# Altium schematic sheet PART9_0_Volt_Protec_Simple.SchDoc
size A4
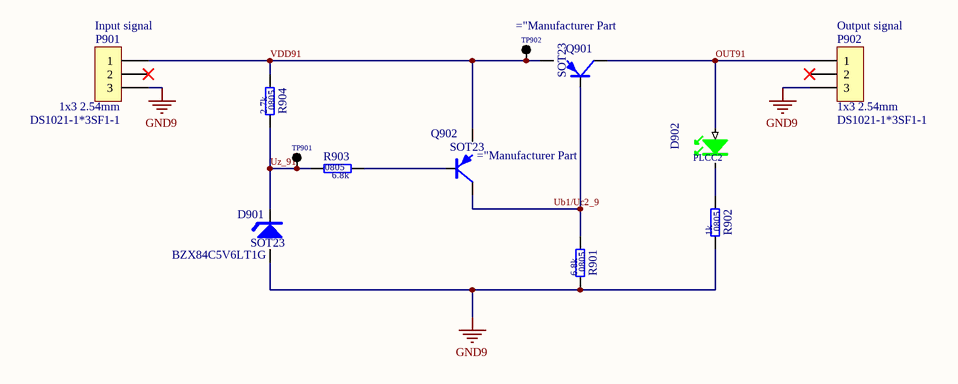
[diagram p0: PART9_0_Volt_Protec_Simple.SchDoc]

## Parts
D901  value BZX84C5V6LT1G  SCH_Footprint: SOT23  [D_SOT23_TO236_SC59]
D902  SCH_Footprint: PLCC2  [OL_PLCC2_3X2X13]
P901  Input signal  value DS1021-1*3SF1-1  SCH_Footprint: 1x3 2.54mm  [P_HEADER_1x3_2.54]
P902  Output signal  value DS1021-1*3SF1-1  SCH_Footprint: 1x3 2.54mm  [P_HEADER_1x3_2.54]
Q901  SCH_Footprint: SOT23  [SOT23_TO236_SC59]  (hidden comment: FMMT718)
Q902  SCH_Footprint: SOT23  [SOT23_TO236_SC59]  (hidden comment: FMMT718)
R901  value 6.8k  SCH_Footprint: 0805  [R_0805_2012]  (hidden comment: Resistor)
R902  value 1k  SCH_Footprint: 0805  [R_0805_2012]  (hidden comment: Resistor)
R903  value 6.8k  SCH_Footprint: 0805  [R_0805_2012]  (hidden comment: Resistor)
R904  value 2.7k  SCH_Footprint: 0805  [R_0805_2012]  (hidden comment: Resistor)
TP901  Single pin  [TP_1PIN]  (value not drawn)
TP902  Single pin  [TP_1PIN]  (value not drawn)

## Nets
GND9: D901.2(A) P901.3 P902.3 R901.1 R902.1
OUT91: D902.2(A) P902.1 Q901.3(C)
Ub1/Uc2_9: Q901.1(B) Q902.3(C) R901.2
Uz_91: D901.1(K) R903.2 R904.1 TP901.1(TP)
VDD91: P901.1 Q901.2(E) Q902.2(E) R904.2 TP902.1(TP)
NetD902_1: D902.1(K) R902.2
NetQ902_1: Q902.1(B) R903.1

Not connected (* = marked no-connect by the designer): P901 2*; P902 2*

## Library data of the parts
D901 = DZ_5V6_SOT23: Zener; Manufacturer: ON Semiconductor; Voltage: 5.6V; Part Number: DZ_5V6_SOT23; Manufacturer Part Number: BZX84C5V6LT1G; Supplier 1: TME; Supplier 2: RS Components; Supplier 3: Farnell; Supplier 4: Mouser; Supplier 5: Digi-Key; Supplier Part Number 5: BZX84C5V6LT1GOSCT-ND
D902 = OL_G_PLCC2: LED GREEN; Part Number: OL_G_PLCC2; Supplier 1: TME; Supplier 2: RS Components; Supplier 3: Farnell; Supplier 4: Mouser; Supplier Part Number 4: 720-LGT676P1Q224Z; Supplier 5: Digi-Key; Supplier Part Number 5: 475-1403-1-ND
P901 P902 = P_HEADER_1x3_2.54: Pin Header; Manufacturer: Connfly; Part Number: P_HEADER_1x3_2.54; Component Type: Standard; HelpURL: http://www.tme.eu/en/Document/cc301e58a5da78cb543a94b5a5b7f06a/DS1021.pdf; Manufacturer Part Number: DS1021-1*3SF1-1; Supplier 1: TME; Supplier Part Number 1: ZL201-03G; Supplier 2: RS Components; Supplier 3: Farnell; Supplier 4: Mouser; Supplier 5: Digi-Key
Q901 Q902 = QPN_FMMT718: Transitor PNP; Manufacturer: Diodes Inc; Voltage: 20V; Current: 1.5A; Value: ="Manufacturer Part; Part Number: QPN_FMMT718; Type: PNP; HelpURL: http://www.farnell.com/datasheets/1899058.pdf?_ga=2.225848856.322626374.1594719330-2144887534.1594719330&_gac=1.162002126.1594799133.Cj0KCQjw0rr4BRCtARIsAB0_48NV0jz3W19pAT9FbVDQVs_LlQ3yp5VjSJuwnIjxTn5Nizq0rEea5YcaAvzMEALw_wcB; Manufacturer Part Number: FMMT718; Supplier 1: TME; Supplier Part Number 1: FMMT718TA; Supplier 2: RS Components; Supplier Part Number 2: 154873; Supplier 3: Farnell; Supplier Part Number 3: 9526463; Supplier 4: Mouser; Supplier Part Number 4: 522-FMMT718TA; Supplier 5: Digi-Key; Supplier Part Number 5: FMMT718CT-ND
R901 R903 = R_6.8k_0805_1: Manufacturer: Royalohm; Manufacturer Part Number: HP05W3F6801T5E; Voltage: 150V; Power: 300mW; Tolerance: 1%; Part Number: R_6.8k_0805_1; HelpURL: https://www.tme.eu/pl/Document/fa390a0a31e891a154d3713216995c6e/HighPowerHP.pdf; Supplier 1: TME; Supplier Part Number 1: HP05-6K81%; Supplier 2: RS Components; Supplier 3: Farnell; Supplier 4: Mouser; Supplier 5: Digi-Key
R902 = R_1k_0805_1: Manufacturer: Royalohm; Manufacturer Part Number: HP05W3F1001T5E; Voltage: 150V; Power: 300mW; Tolerance: 1%; Part Number: R_1k_0805_1; HelpURL: https://www.tme.eu/pl/Document/63d5a2fbb689d2d511047d7cc8640cd8/chip_resistor_hp.pdf; Supplier 1: TME; Supplier Part Number 1: HP05-1K1%; Supplier 2: RS Components; Supplier 3: Farnell; Supplier 4: Mouser; Supplier 5: Digi-Key
R904 = R_2.7k_0805_1: Manufacturer: Royalohm; Manufacturer Part Number: HP05W3F2701T5E; Voltage: 150V; Power: 300mW; Tolerance: 1%; Part Number: R_2.7k_0805_1; HelpURL: https://www.tme.eu/pl/Document/fa390a0a31e891a154d3713216995c6e/HighPowerHP.pdf; Supplier 1: TME; Supplier Part Number 1: HP05-2K71%; Supplier 2: RS Components; Supplier 3: Farnell; Supplier 4: Mouser; Supplier 5: Digi-Key
TP901 TP902 = TP_1PIN: Testpoint; SCH_Footprint: Single; Part Number: TP_1PIN; Component Type: Standard; Supplier 1: TME; Supplier 2: RS Components; Supplier 3: Farnell; Supplier 4: Mouser; Supplier 5: Digi-Key